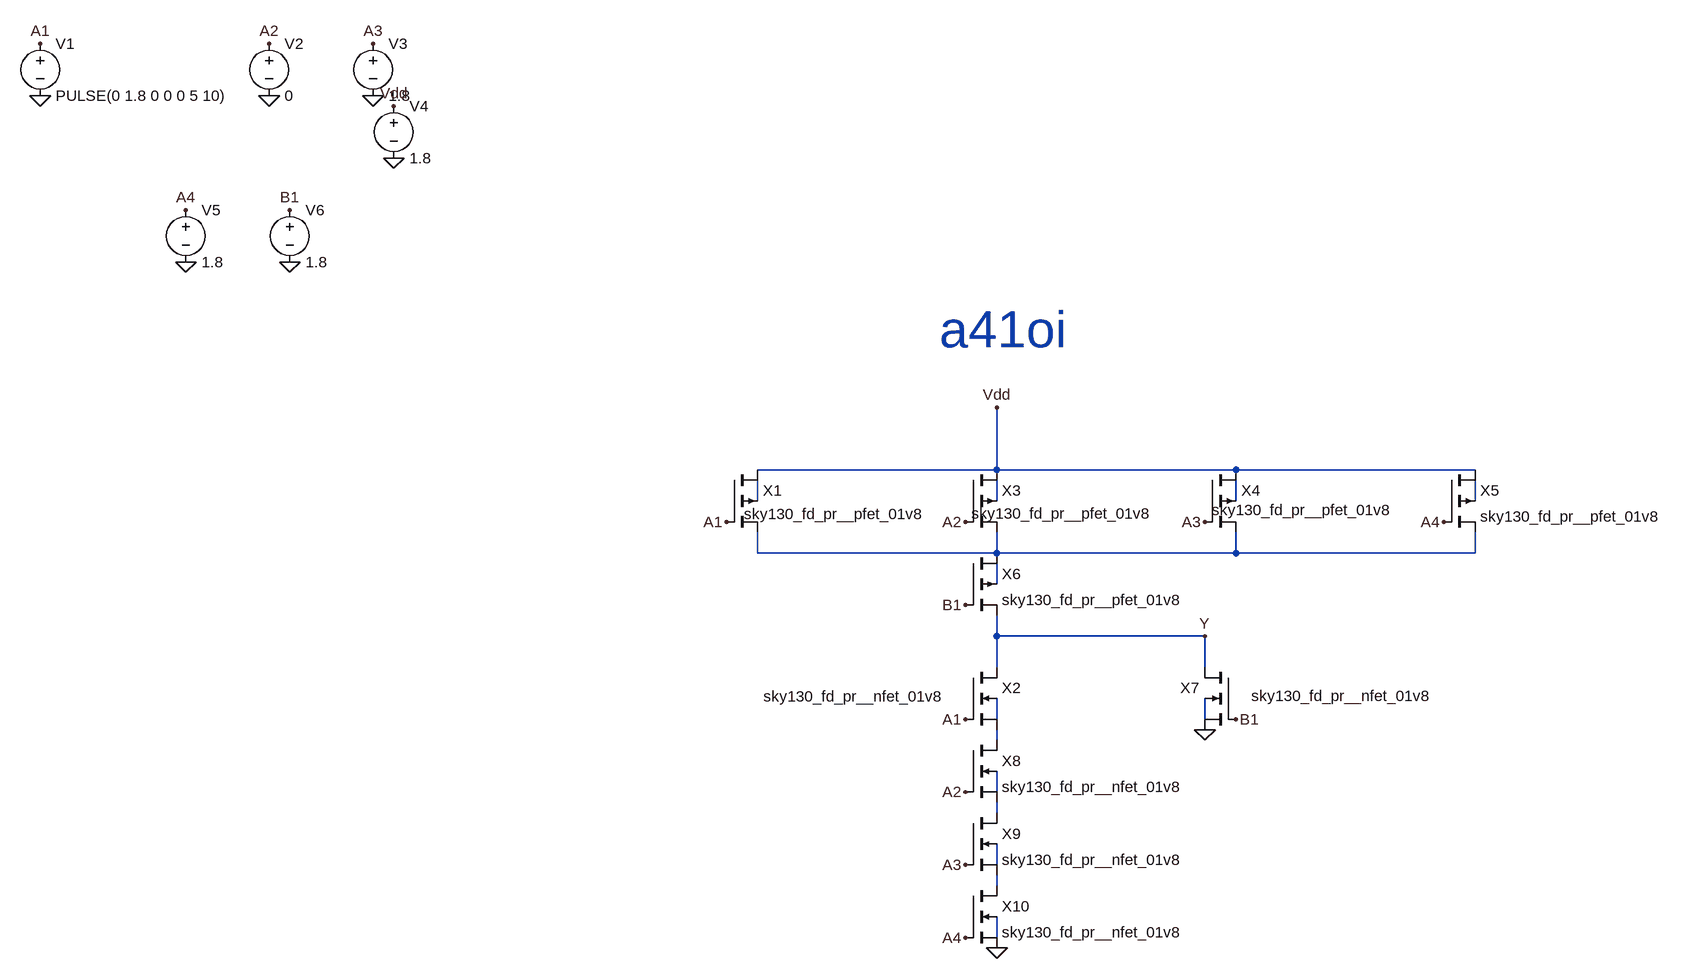
[diagram p0: schematic a41oi.asc]
a41oi.asc, the LTspice schematic file:
Version 4
SHEET 1 1488 876
WIRE 432 96 432 0
WIRE 432 96 64 96
WIRE 800 96 432 96
WIRE 1168 96 800 96
WIRE 64 144 64 112
WIRE 432 144 432 112
WIRE 800 144 800 112
WIRE 1168 144 1168 112
WIRE 64 224 64 192
WIRE 432 224 432 192
WIRE 432 224 64 224
WIRE 800 224 800 192
WIRE 800 224 432 224
WIRE 1168 224 1168 192
WIRE 1168 224 800 224
WIRE 432 272 432 240
WIRE 432 352 432 320
WIRE 752 352 432 352
WIRE 432 400 432 352
WIRE 752 400 752 352
WIRE 432 480 432 448
WIRE 752 480 752 448
WIRE 432 512 432 496
WIRE 432 592 432 560
WIRE 432 624 432 608
WIRE 432 704 432 672
WIRE 432 736 432 720
WIRE 432 816 432 784
FLAG 432 832 0
FLAG 432 0 Vdd
FLAG 752 496 0
FLAG -1040 -480 0
FLAG -688 -480 0
FLAG -528 -480 0
FLAG -1040 -560 A1
FLAG -688 -560 A2
FLAG -528 -560 A3
FLAG -496 -464 Vdd
FLAG -496 -384 0
FLAG -816 -224 0
FLAG -816 -304 A4
FLAG -656 -224 0
FLAG -656 -304 B1
FLAG 16 176 A1
FLAG 384 176 A2
FLAG 752 176 A3
FLAG 1120 176 A4
FLAG 384 304 B1
FLAG 800 480 B1
FLAG 384 480 A1
FLAG 384 592 A2
FLAG 384 704 A3
FLAG 384 816 A4
FLAG 752 352 Y
SYMBOL pmos4 16 96 R0
WINDOW 3 27 68 Left 2
SYMATTR Value sky130_fd_pr__pfet_01v8
SYMATTR InstName X1
SYMATTR Value2 l=0.13u w=4u
SYMBOL nmos4 384 400 R0
WINDOW 3 -311 45 Left 2
SYMATTR Value sky130_fd_pr__nfet_01v8
SYMATTR InstName X2
SYMATTR Value2 l=0.13u w=2u
SYMBOL pmos4 384 96 R0
WINDOW 3 9 67 Left 2
SYMATTR Value sky130_fd_pr__pfet_01v8
SYMATTR InstName X3
SYMATTR Value2 l=0.13u w=4u
SYMBOL pmos4 752 96 R0
WINDOW 3 11 62 Left 2
SYMATTR InstName X4
SYMATTR Value2 l=0.13u w=4u
SYMATTR Value sky130_fd_pr__pfet_01v8
SYMBOL pmos4 1120 96 R0
SYMATTR InstName X5
SYMATTR Value2 l=0.13u w=4u
SYMATTR Value sky130_fd_pr__pfet_01v8
SYMBOL pmos4 384 224 R0
SYMATTR InstName X6
SYMATTR Value2 l=0.13u w=4u
SYMATTR Value sky130_fd_pr__pfet_01v8
SYMBOL nmos4 800 400 M0
WINDOW 3 -303 44 Left 2
SYMATTR InstName X7
SYMATTR Value2 l=0.13u w=2u
SYMATTR Value sky130_fd_pr__nfet_01v8
SYMBOL nmos4 384 512 R0
SYMATTR InstName X8
SYMATTR Value2 l=0.13u w=2u
SYMATTR Value sky130_fd_pr__nfet_01v8
SYMBOL nmos4 384 624 R0
SYMATTR InstName X9
SYMATTR Value2 l=0.13u w=2u
SYMATTR Value sky130_fd_pr__nfet_01v8
SYMBOL nmos4 384 736 R0
SYMATTR InstName X10
SYMATTR Value2 l=0.13u w=2u
SYMATTR Value sky130_fd_pr__nfet_01v8
SYMBOL voltage -1040 -576 R0
WINDOW 123 0 0 Left 0
WINDOW 39 0 0 Left 0
SYMATTR InstName V1
SYMATTR Value PULSE(0 1.8 0 0 0 5 10)
SYMBOL voltage -688 -576 R0
WINDOW 123 0 0 Left 0
WINDOW 39 0 0 Left 0
SYMATTR InstName V2
SYMATTR Value 0
SYMBOL voltage -528 -576 R0
WINDOW 123 0 0 Left 0
WINDOW 39 0 0 Left 0
SYMATTR InstName V3
SYMATTR Value 1.8
SYMBOL voltage -496 -480 R0
WINDOW 123 0 0 Left 0
WINDOW 39 0 0 Left 0
SYMATTR InstName V4
SYMATTR Value 1.8
SYMBOL voltage -816 -320 R0
WINDOW 123 0 0 Left 0
WINDOW 39 0 0 Left 0
SYMATTR InstName V5
SYMATTR Value 1.8
SYMBOL voltage -656 -320 R0
WINDOW 123 0 0 Left 0
WINDOW 39 0 0 Left 0
SYMATTR InstName V6
SYMATTR Value 1.8
TEXT 344 -120 Left 6 ;a41oi

The netlist it stands for:
* a41oi.asc
M§X1 Vdd A1 N005 N001 sky130_fd_pr__pfet_01v8 l=0.13u w=4u
M§X2 Y A1 N009 N007 sky130_fd_pr__nfet_01v8 l=0.13u w=2u
M§X3 Vdd A2 N005 N002 sky130_fd_pr__pfet_01v8 l=0.13u w=4u
M§X4 Vdd A3 N005 N003 sky130_fd_pr__pfet_01v8 l=0.13u w=4u
M§X5 Vdd A4 N005 N004 sky130_fd_pr__pfet_01v8 l=0.13u w=4u
M§X6 N005 B1 Y N006 sky130_fd_pr__pfet_01v8 l=0.13u w=4u
M§X7 Y B1 0 N008 sky130_fd_pr__nfet_01v8 l=0.13u w=2u
M§X8 N009 A2 N011 N010 sky130_fd_pr__nfet_01v8 l=0.13u w=2u
M§X9 N011 A3 N013 N012 sky130_fd_pr__nfet_01v8 l=0.13u w=2u
M§X10 N013 A4 0 N014 sky130_fd_pr__nfet_01v8 l=0.13u w=2u
V1 A1 0 PULSE(0 1.8 0 0 0 5 10)
V2 A2 0 0
V3 A3 0 1.8
V4 Vdd 0 1.8
V5 A4 0 1.8
V6 B1 0 1.8
.model NMOS NMOS
.model PMOS PMOS
.lib standard.mos
* a41oi
.backanno
.end